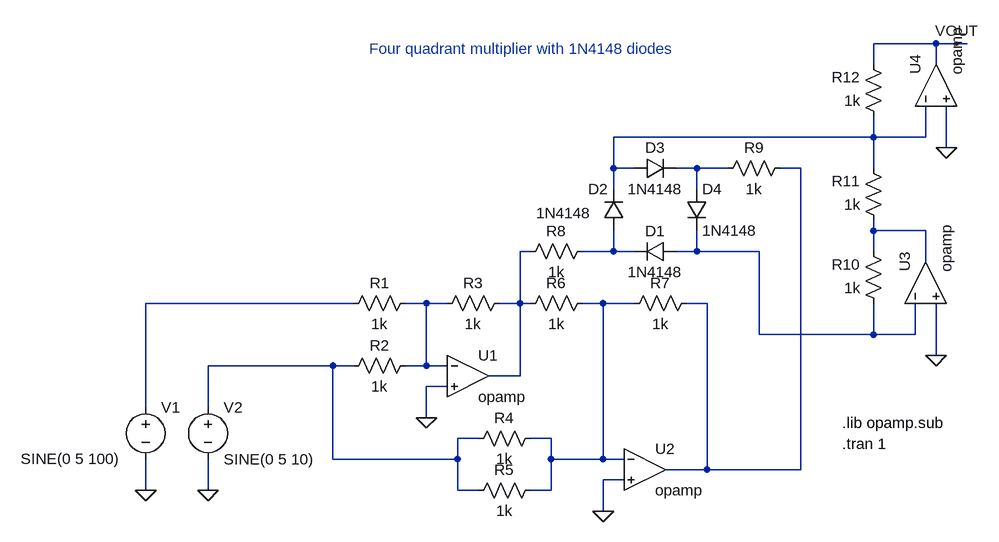
[diagram p0: schematic Draft1.asc]
Draft1.asc, the LTspice schematic file:
Version 4
SHEET 1 880 680
WIRE 720 -432 624 -432
WIRE 752 -432 720 -432
WIRE 768 -432 752 -432
WIRE 624 -400 624 -432
WIRE 720 -400 720 -432
WIRE 624 -288 624 -320
WIRE 624 -288 224 -288
WIRE 704 -288 704 -336
WIRE 704 -288 624 -288
WIRE 736 -272 736 -336
WIRE 224 -240 224 -288
WIRE 256 -240 224 -240
WIRE 352 -240 320 -240
WIRE 400 -240 352 -240
WIRE 512 -240 480 -240
WIRE 624 -240 624 -288
WIRE 224 -208 224 -240
WIRE 352 -208 352 -240
WIRE 624 -144 624 -160
WIRE 704 -144 624 -144
WIRE 96 -112 80 -112
WIRE 224 -112 224 -144
WIRE 224 -112 176 -112
WIRE 256 -112 224 -112
WIRE 352 -112 352 -144
WIRE 352 -112 320 -112
WIRE 448 -112 352 -112
WIRE 624 -112 624 -144
WIRE 704 -96 704 -144
WIRE -176 -32 -496 -32
WIRE -64 -32 -96 -32
WIRE -32 -32 -64 -32
WIRE 80 -32 80 -112
WIRE 80 -32 48 -32
WIRE 96 -32 80 -32
WIRE 208 -32 176 -32
WIRE 256 -32 208 -32
WIRE 368 -32 336 -32
WIRE 448 16 448 -112
WIRE 624 16 624 -32
WIRE 624 16 448 16
WIRE 688 16 688 -32
WIRE 688 16 624 16
WIRE 720 48 720 -32
WIRE -208 64 -400 64
WIRE -176 64 -208 64
WIRE -64 64 -64 -32
WIRE -64 64 -96 64
WIRE -32 64 -64 64
WIRE 80 80 80 -32
WIRE 80 80 32 80
WIRE -32 96 -64 96
WIRE -496 128 -496 -32
WIRE -400 128 -400 64
WIRE -64 144 -64 96
WIRE 16 176 -16 176
WIRE 128 176 96 176
WIRE -208 208 -208 64
WIRE -16 208 -16 176
WIRE -16 208 -208 208
WIRE 128 208 128 176
WIRE 208 208 208 -32
WIRE 208 208 128 208
WIRE 240 208 208 208
WIRE 368 224 368 -32
WIRE 368 224 304 224
WIRE 512 224 512 -240
WIRE 512 224 368 224
WIRE 240 240 208 240
WIRE -496 256 -496 208
WIRE -400 256 -400 208
WIRE -16 256 -16 208
WIRE 16 256 -16 256
WIRE 128 256 128 208
WIRE 128 256 96 256
WIRE 208 288 208 240
FLAG -400 256 0
FLAG -496 256 0
FLAG -64 144 0
FLAG 208 288 0
FLAG 720 48 0
FLAG 736 -272 0
FLAG 752 -432 VOUT
SYMBOL OpAmps\\opamp 0 16 R0
SYMATTR InstName U1
SYMBOL OpAmps\\opamp 272 160 R0
SYMATTR InstName U2
SYMBOL voltage -496 112 R0
WINDOW 3 -192 95 Left 2
WINDOW 123 0 0 Left 0
WINDOW 39 0 0 Left 0
SYMATTR InstName V1
SYMATTR Value SINE(0 5 100)
SYMBOL voltage -400 112 R0
WINDOW 123 0 0 Left 0
WINDOW 39 0 0 Left 0
SYMATTR InstName V2
SYMATTR Value SINE(0 5 10)
SYMBOL res -80 -48 R90
WINDOW 0 0 56 VBottom 2
WINDOW 3 32 56 VTop 2
SYMATTR InstName R1
SYMATTR Value 1k
SYMBOL res -80 48 R90
WINDOW 0 0 56 VBottom 2
WINDOW 3 32 56 VTop 2
SYMATTR InstName R2
SYMATTR Value 1k
SYMBOL res 64 -48 R90
WINDOW 0 0 56 VBottom 2
WINDOW 3 32 56 VTop 2
SYMATTR InstName R3
SYMATTR Value 1k
SYMBOL res 112 160 R90
WINDOW 0 0 56 VBottom 2
WINDOW 3 32 56 VTop 2
SYMATTR InstName R4
SYMATTR Value 1k
SYMBOL res 112 240 R90
WINDOW 0 0 56 VBottom 2
WINDOW 3 32 56 VTop 2
SYMATTR InstName R5
SYMATTR Value 1k
SYMBOL res 192 -48 R90
WINDOW 0 0 56 VBottom 2
WINDOW 3 32 56 VTop 2
SYMATTR InstName R6
SYMATTR Value 1k
SYMBOL res 352 -48 R90
WINDOW 0 0 56 VBottom 2
WINDOW 3 32 56 VTop 2
SYMATTR InstName R7
SYMATTR Value 1k
SYMBOL res 192 -128 R90
WINDOW 0 0 56 VBottom 2
WINDOW 3 32 56 VTop 2
SYMATTR InstName R8
SYMATTR Value 1k
SYMBOL diode 320 -128 R90
WINDOW 0 0 32 VBottom 2
WINDOW 3 32 32 VTop 2
SYMATTR InstName D1
SYMATTR Value 1N4148
SYMBOL diode 240 -144 R180
WINDOW 0 24 64 Left 2
WINDOW 3 50 27 Left 2
SYMATTR InstName D2
SYMATTR Value 1N4148
SYMBOL diode 256 -224 R270
WINDOW 0 32 32 VTop 2
WINDOW 3 0 32 VBottom 2
SYMATTR InstName D3
SYMATTR Value 1N4148
SYMBOL diode 336 -208 R0
SYMATTR InstName D4
SYMATTR Value 1N4148
SYMBOL res 496 -256 R90
WINDOW 0 0 56 VBottom 2
WINDOW 3 32 56 VTop 2
SYMATTR InstName R9
SYMATTR Value 1k
SYMBOL OpAmps\\opamp 640 -64 R270
SYMATTR InstName U3
SYMBOL res 640 -16 R180
WINDOW 0 36 76 Left 2
WINDOW 3 36 40 Left 2
SYMATTR InstName R10
SYMATTR Value 1k
SYMBOL res 640 -144 R180
WINDOW 0 36 76 Left 2
WINDOW 3 36 40 Left 2
SYMATTR InstName R11
SYMATTR Value 1k
SYMBOL res 640 -304 R180
WINDOW 0 36 76 Left 2
WINDOW 3 36 40 Left 2
SYMATTR InstName R12
SYMATTR Value 1k
SYMBOL OpAmps\\opamp 656 -368 R270
SYMATTR InstName U4
TEXT 576 152 Left 2 !.lib opamp.sub
TEXT 576 184 Left 2 !.tran 1
TEXT -152 -424 Left 2 ;Four quadrant multiplier with 1N4148 diodes

The netlist it stands for:
* Draft1.asc
XU1 N009 0 N005 opamp Aol=100K GBW=10Meg  ; pins invin noninvin out
XU2 N010 0 N003 opamp Aol=100K GBW=10Meg  ; pins invin noninvin out
V1 N008 0 SINE(0 5 100)
V2 N011 0 SINE(0 5 10)
R1 N009 N008 1k
R2 N009 N011 1k
R3 N005 N009 1k
R4 N010 N011 1k
R5 N010 N011 1k
R6 N010 N005 1k
R7 N003 N010 1k
R8 N006 N005 1k
D1 N007 N006 1N4148
D2 N006 N001 1N4148
D3 N001 N002 1N4148
D4 N002 N007 1N4148
R9 N003 N002 1k
XU3 N007 0 N004 opamp Aol=100K GBW=10Meg  ; pins invin noninvin out
R10 N007 N004 1k
R11 N004 N001 1k
R12 N001 VOUT 1k
XU4 N001 0 VOUT opamp Aol=100K GBW=10Meg  ; pins invin noninvin out
.model D D
.lib standard.dio
.lib opamp.sub
.tran 1
* Four quadrant multiplier with 1N4148 diodes
.backanno
.end